# Altium project E-Nose&Alphasense.PrjPCB
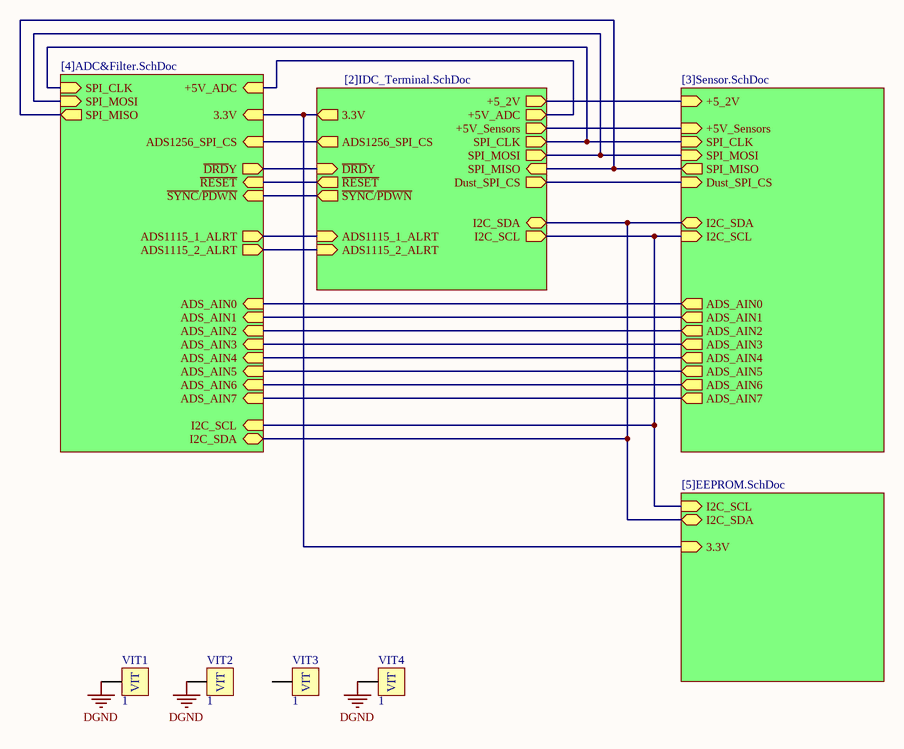
[diagram p0: [1]SheetMain.SchDoc]
5 sheets, 136 parts. Net scope: flat (ports and power ports of the same name join across sheets).
Board file: E-Nose&Alphasense.PcbDoc
Sheets:
  [1]SheetMain.SchDoc
    U_[2]IDC_Terminal = [2]IDC_Terminal.SchDoc
    U_[3]Sensor = [3]Sensor.SchDoc
    U_[4]ADC&Filter = [4]ADC&Filter.SchDoc
    U_[5]EEPROM = [5]EEPROM.SchDoc

## Sheet [1]SheetMain.SchDoc: SheetMain
size A4; Organization: Altium Limited; Address1: SPARC Lab; Address2: SEEE-HUST; Address3: Dai Co Viet, Ha Noi; DocumentNumber: 1; SheetNumber: 1; SheetTotal: 5

### Parts
VIT1  1  [Screw Hole 4mm]
VIT2  1  [Screw Hole 4mm]
VIT3  1  [Screw Hole 4mm]
VIT4  1  [Screw Hole 4mm]

### Sub-sheets
U_[2]IDC_Terminal = [2]IDC_Terminal.SchDoc: 3.3V (out), Dust_SPI_CS (out), SPI_MISO (in), SPI_MOSI (out), SPI_CLK (out), ADS1256_SPI_CS (out), ~{DRD}Y (in), ~{RESET} (out), ~{SYNC}/~{PDWN} (out), I2C_SCL (out), I2C_SDA (bidir), ADS1115_1_ALRT (in), ADS1115_2_ALRT (in), +5_2V (out), +5V_Sensors (out), +5V_ADC (out)
U_[3]Sensor = [3]Sensor.SchDoc: +5_2V (in), SPI_CLK (in), SPI_MISO (out), SPI_MOSI (in), Dust_SPI_CS (in), ADS_AIN0 (out), +5V_Sensors (in), ADS_AIN4 (out), ADS_AIN7 (out), ADS_AIN6 (out), ADS_AIN5 (out), ADS_AIN1 (out), ADS_AIN3 (out), ADS_AIN2 (out), I2C_SDA (bidir), I2C_SCL (in)
U_[4]ADC&Filter = [4]ADC&Filter.SchDoc: ADS_AIN3 (in), ~{DRD}Y (out), ADS1256_SPI_CS (in), ~{RESET} (in), ~{SYNC}/~{PDWN} (in), SPI_MISO (out), +5V_ADC (in), 3.3V (in), ADS_AIN2 (in), ADS_AIN6 (in), ADS_AIN1 (in), ADS_AIN4 (in), ADS_AIN5 (in), ADS_AIN7 (in), SPI_MOSI (in), SPI_CLK (in), ADS_AIN0 (in), I2C_SCL (in), ADS1115_1_ALRT (out), ADS1115_2_ALRT (out), I2C_SDA (bidir)
U_[5]EEPROM = [5]EEPROM.SchDoc: I2C_SCL (in), I2C_SDA (bidir), 3.3V (in)

### Nets
DGND: VIT1.1 VIT2.1 VIT4.1
(unnamed): sheet U_[2]IDC_Terminal/3.3V, sheet U_[4]ADC&Filter/3.3V, sheet U_[5]EEPROM/3.3V
(unnamed): sheet U_[2]IDC_Terminal/Dust_SPI_CS, sheet U_[3]Sensor/Dust_SPI_CS
(unnamed): sheet U_[2]IDC_Terminal/SPI_MISO, sheet U_[3]Sensor/SPI_MISO, sheet U_[4]ADC&Filter/SPI_MISO
(unnamed): sheet U_[2]IDC_Terminal/SPI_MOSI, sheet U_[3]Sensor/SPI_MOSI, sheet U_[4]ADC&Filter/SPI_MOSI
(unnamed): sheet U_[2]IDC_Terminal/SPI_CLK, sheet U_[3]Sensor/SPI_CLK, sheet U_[4]ADC&Filter/SPI_CLK
(unnamed): sheet U_[2]IDC_Terminal/ADS1256_SPI_CS, sheet U_[4]ADC&Filter/ADS1256_SPI_CS
(unnamed): sheet U_[2]IDC_Terminal/~{DRD}Y, sheet U_[4]ADC&Filter/~{DRD}Y
(unnamed): sheet U_[2]IDC_Terminal/~{RESET}, sheet U_[4]ADC&Filter/~{RESET}
(unnamed): sheet U_[2]IDC_Terminal/~{SYNC}/~{PDWN}, sheet U_[4]ADC&Filter/~{SYNC}/~{PDWN}
(unnamed): sheet U_[2]IDC_Terminal/I2C_SCL, sheet U_[3]Sensor/I2C_SCL, sheet U_[4]ADC&Filter/I2C_SCL, sheet U_[5]EEPROM/I2C_SCL
(unnamed): sheet U_[2]IDC_Terminal/I2C_SDA, sheet U_[3]Sensor/I2C_SDA, sheet U_[4]ADC&Filter/I2C_SDA, sheet U_[5]EEPROM/I2C_SDA
(unnamed): sheet U_[2]IDC_Terminal/ADS1115_1_ALRT, sheet U_[4]ADC&Filter/ADS1115_1_ALRT
(unnamed): sheet U_[2]IDC_Terminal/ADS1115_2_ALRT, sheet U_[4]ADC&Filter/ADS1115_2_ALRT
(unnamed): sheet U_[2]IDC_Terminal/+5_2V, sheet U_[3]Sensor/+5_2V
(unnamed): sheet U_[2]IDC_Terminal/+5V_Sensors, sheet U_[3]Sensor/+5V_Sensors
(unnamed): sheet U_[2]IDC_Terminal/+5V_ADC, sheet U_[4]ADC&Filter/+5V_ADC
(unnamed): sheet U_[3]Sensor/ADS_AIN0, sheet U_[4]ADC&Filter/ADS_AIN0
(unnamed): sheet U_[3]Sensor/ADS_AIN4, sheet U_[4]ADC&Filter/ADS_AIN4
(unnamed): sheet U_[3]Sensor/ADS_AIN7, sheet U_[4]ADC&Filter/ADS_AIN7
(unnamed): sheet U_[3]Sensor/ADS_AIN6, sheet U_[4]ADC&Filter/ADS_AIN6
(unnamed): sheet U_[3]Sensor/ADS_AIN5, sheet U_[4]ADC&Filter/ADS_AIN5
(unnamed): sheet U_[3]Sensor/ADS_AIN1, sheet U_[4]ADC&Filter/ADS_AIN1
(unnamed): sheet U_[3]Sensor/ADS_AIN3, sheet U_[4]ADC&Filter/ADS_AIN3
(unnamed): sheet U_[3]Sensor/ADS_AIN2, sheet U_[4]ADC&Filter/ADS_AIN2

Not connected (* = marked no-connect by the designer): VIT3 1

### Notes on the sheet
- Title
- Size:
- Date:
- A4
- Number:
- Time:
- Revision:
- Sheet
- of
- File:

### Library data of the parts
VIT1-VIT4 = VIT: Vit xuyen lo; Chung_Loai: Cắm; Ma_Hang: MH002051; Ten_Linh_Kien: CON 2 KF142R 5.08MM; Don_Vi: Con; Ghi_Chu: *; Kieu_Chan: *

## Sheet [2]IDC_Terminal.SchDoc: IDC&Terminal
size A4; Organization: Altium Limited; Address1: SPARC Lab; Address2: SEEE-HUST; Address3: Dai Co Viet, Ha Noi; DocumentNumber: 2; SheetNumber: 2; SheetTotal: 5
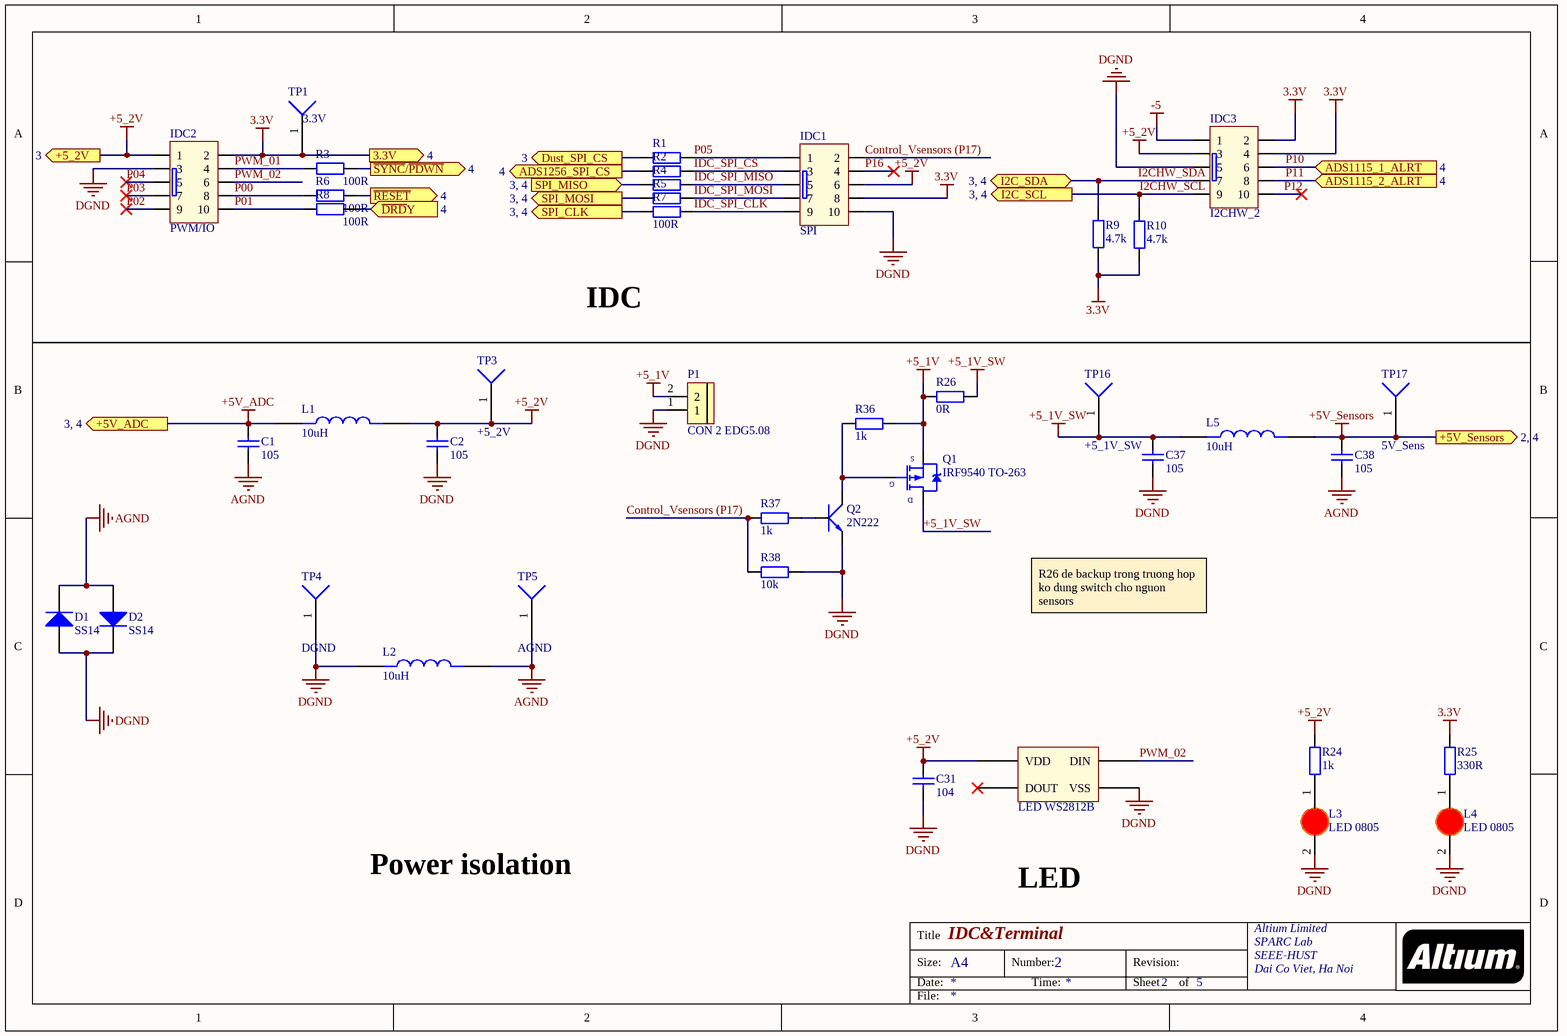
[diagram p1: [2]IDC_Terminal.SchDoc]

### Parts
C1  105  [tu 0805]
C2  105  [tu 0805]
C31  104  [tu 0805]
C37  105  [tu 0805]
C38  105  [tu 0805]
D1  SS14  [DIODE SMA]
D2  SS14  [DIODE SMA]
IDC1  SPI  [IDC10]
IDC2  PWM/IO  [IDC10]
IDC3  I2CHW_2  [IDC10]
L1  10uH  [Inductor 0805]
L2  10uH  [Inductor 0805]
L3  LED 0805  [LED-0805-Red]
L4  LED 0805  [LED-0805-Red]
L5  10uH  [Inductor 0805]
LED_WS2812B  LED WS2812B  [LED-WS2812B]
P1  CON 2 EDG5.08  [CON 2 2EDG5.08]
Q1  IRF9540 TO-263  [TO-263-3_MOSFET]
Q2  2N222  [SOT23-231]
R1  100R  [tro smd 0805]  (value not drawn)
R2  100R  [tro smd 0805]  (value not drawn)
R3  100R  [tro smd 0805]
R4  100R  [tro smd 0805]  (value not drawn)
R5  100R  [tro smd 0805]  (value not drawn)
R6  100R  [tro smd 0805]
R7  100R  [tro smd 0805]
R8  100R  [tro smd 0805]
R9  4.7k  [tro smd 0805]
R10  4.7k  [tro smd 0805]
R24  1k  [tro smd 0805]
R25  330R  [Tro SMD 0805]
R26  0R  [tro smd 1206]
R36  1k  [tro smd 0805]
R37  1k  [tro smd 0805]
R38  10k  [tro smd 0805]
TP1  3.3V  [pad_1.65x1.65_hole_1mm]
TP3  +5_2V  [pad_1.65x1.65_hole_1mm]
TP4  DGND  [pad_1.65x1.65_hole_1mm]
TP5  AGND  [pad_1.65x1.65_hole_1mm]
TP16  +5_1V_SW  [pad_1.65x1.65_hole_1mm]
TP17  5V_Sens  [pad_1.65x1.65_hole_1mm]

### Ports
3.3V (out, see 4), +5_2V (out, see 3), +5V_ADC (out, see 3, 4), +5V_Sensors (out, see 2, 4), ADS1115_1_ALRT (in, see 4), ADS1115_2_ALRT (in, see 4), ADS1256_SPI_CS (out, see 4), Dust_SPI_CS (out, see 3), I2C_SCL (out, see 3, 4), I2C_SDA (bidir, see 3, 4), SPI_CLK (out, see 3, 4), SPI_MISO (in, see 3, 4), SPI_MOSI (out, see 3, 4), ~{DRD}Y (in, see 4), ~{RESET} (out, see 4), ~{SYNC}/~{PDWN} (out, see 4)

### Nets
3.3V: IDC1.8 IDC2.2 IDC3.2 IDC3.4 R9.1 R10.1 R25.2 TP1.1 ; port 3.3V
+5_1V: P1.2 Q1.3(S) R26.1 R36.2
+5_1V_SW: C37.1 L5.2 Q1.2(D) R26.2 TP16.1
+5_2V: C2.1 C31.1 IDC1.6 IDC2.1 IDC3.3 L1.2 LED_WS2812B.1-VDD(VDD) R24.1 TP3.1 ; port +5_2V
+5V_ADC: C1.1 L1.1 ; port +5V_ADC
+5V_Sensors: C38.1 L5.1 TP17.1 ; port +5V_Sensors
-5: IDC3.1
AGND: C1.2 C38.2 D1.2(K) D2.1(A) L2.2 TP5.1
DGND: C2.2 C31.2 C37.2 D1.1(A) D2.2(K) IDC1.10 IDC2.3 IDC3.5 L2.1 L3.2(K) L4.2(K) LED_WS2812B.3-GND(VSS) P1.1 Q2.1(E) R38.2 TP4.1
Control_Vsensors (P17): IDC1.2 R37.1 R38.1
I2CHW_SCL: IDC3.9 R10.2 ; port I2C_SCL  [project net I2C_SCL]
I2CHW_SDA: IDC3.7 R9.2 ; port I2C_SDA  [project net I2C_SDA]
IDC_SPI_CLK: IDC1.9 R7.2
IDC_SPI_CS: IDC1.3 R2.2
IDC_SPI_MISO: IDC1.5 R4.2
IDC_SPI_MOSI: IDC1.7 R5.2
P00: IDC2.8 R6.2
P01: IDC2.10 R8.2
P02: IDC2.9
P03: IDC2.7
P04: IDC2.5
P05: IDC1.1 R1.2
P10: IDC3.6 ; port ADS1115_1_ALRT
P11: IDC3.8 ; port ADS1115_2_ALRT
P12: IDC3.10
P16: IDC1.4
PWM_01: IDC2.4 R3.2
PWM_02: IDC2.6 LED_WS2812B.4-DIN(DIN)
NetH5_2: R7.1 ; port SPI_CLK
NetH5_3: R4.1 ; port SPI_MISO
NetH5_4: R5.1 ; port SPI_MOSI
NetH5_5: R1.1 ; port Dust_SPI_CS
NetL3_1: L3.1(A) R24.2
NetL4_1: L4.1(A) R25.1
NetQ1_1: Q1.1(G) Q2.3(C) R36.1
NetQ2_2: Q2.2(B) R37.2
NetR2_1: R2.1 ; port ADS1256_SPI_CS
NetR3_1: R3.1 ; port ~{SYNC}/~{PDWN}
NetR6_1: R6.1 ; port ~{RESET}
NetR8_1: R8.1 ; port ~{DRD}Y

Not connected (* = marked no-connect by the designer): LED_WS2812B 2-DOUT(DOUT)*

### Notes on the sheet
- IDC
- R26 de backup trong truong hop ko dung switch cho nguon sensors
- Power isolation
- LED
- Title
- Size:
- Date:
- A4
- Number:
- Time:
- Revision:
- Sheet
- of
- File:

### Library data of the parts
C1 C2 C37 C38 = Tu 0805 105 50V 10%: Dán; Don_Vi: Con; So_Chan: 2; Ten_Linh_Kien: Tụ 0805 105-1uF 10% 50V; Ma_Hang: MH004552; Chung_Loai: Dán; Kieu_Chan: *
C31 = Tu 0805 104 50V 10%: Dán; Don_Vi: Con; So_Chan: 2; Ten_Linh_Kien: Tụ 0805 104-100nF 10% 50V; Ma_Hang: MH004551; Chung_Loai: Dán; Kieu_Chan: *
D1 D2 = Diode SS14 ( 1N5819): Dán; Ma_Hang: MH002211; Don_Vi: Con; Ten_Linh_Kien: Diode SS14 DO214 Schottky 1A 40V ( 1N5819 DO214); Chung_Loai: Dán; Ghi_Chu: *; Kieu_Chan: *
IDC1-IDC3 = IDC 5X2: Value: Header 5x2
L1 L2 L5 = Cuon cam 0805: 1.5ÂµH Unshielded Multilayer Inductor 700mA 220mOhm 0805 (2012 Metric); MF: Laird; MP: CPI0805G1R5R-10; Value: *; Price: None; Package: 0805 Laird; Availability: Not in stock; Check_prices: https://www.snapeda.com/parts/CPI0805G1R5R-10/Laird/view-part/5881135/?ref=eda; SnapEDA_Link: https://www.snapeda.com/parts/CPI0805G1R5R-10/Laird/view-part/5881135/?ref=snap
L3 L4 = LED 0805 Do: Dán; Don_Vi: Con; Ma_Hang: MH000897; Ten_Linh_Kien: LED 0805 Màu Đỏ (Red); Ghi_Chu: *; Kieu_Chan: *; Chung_Loai: Dán
P1 = CON 2 EDG5.08: Cắm; Ten_Linh_Kien: CON 2 2EDG5.08-2P 5.08MM ( Xanh Cong); Ma_Hang: MH000759; Ghi_Chu: *; Don_Vi: Con; Kieu_Chan: *; Chung_Loai: Cắm
Q1 = IRF9540 SMD: P-Channel Power MOSFET; Note: Pin 2 is electrically connected to pin 4.; Published: 8-Jun-2000; LatestRevisionDate: 17-Jul-2002; LatestRevisionNote: Re-released for DXP Platform.; DatasheetVersion: PD-9.421C; PackageVersion: Feb-1997; PackageReference: TO-220AB; Publisher: Altium Limited; PackageDescription: TO, Thru-Hole, Vertical, Heatsink Mounted; 3 In-Line Leads; Pitch 2.54 mm; ComponentLink1Description: Manufacturer Link; ComponentLink1URL: http://www.irf.com/; ComponentLink2Description: Datasheet; ComponentLink2URL: http://www.irf.com/product-info/datasheets/data/irf9540.pdf
Q2 = 2N222: NPN 600mW, ECB; Value: C1815
R1-R8 = Tro 0805 5% 100R: Dán; Don_Vi: Con; So_Chan: 2; Ten_Linh_Kien: Trở 0805 5% 100R; Ma_Hang: MH005251; Chung_Loai: Dán; Kieu_Chan: *
R9 R10 = Tro 0805 5% 4.7k: Dán; Don_Vi: Con; So_Chan: 2; Ten_Linh_Kien: Trở 0805 5% 4.7k; Ma_Hang: MH005307; Chung_Loai: Dán; Kieu_Chan: *
R24 = Tro 0805 5% 1k: Dán; Don_Vi: Con; So_Chan: 2; Ten_Linh_Kien: Trở 0805 5% 1k; Ma_Hang: MH005234; Chung_Loai: Dán; Kieu_Chan: *
R25 = Tro 0805 5% 330R: Dán; Don_Vi: Con; So_Chan: 2; Ten_Linh_Kien: Trở 0805 5% 330R; Ma_Hang: MH005337; Chung_Loai: Dán; Kieu_Chan: *
R26 = Tro 1206 5% 0R: Dán; Don_Vi: Con; So_Chan: 2; Ten_Linh_Kien: Trở 1206 5% 0R; Ma_Hang: MH005902; Chung_Loai: Dán; Kieu_Chan: *
R36 R37 = Tro 0805 1% 1k: Dán; Don_Vi: Con; So_Chan: 2; Ten_Linh_Kien: Trở 0805 1% 1k; Ma_Hang: MH005468; Chung_Loai: Dán; Kieu_Chan: *
R38 = Tro 0805 1% 10k: Dán; Don_Vi: Con; So_Chan: 2; Ten_Linh_Kien: Trở 0805 1% 10k; Ma_Hang: MH005473; Chung_Loai: Dán; Kieu_Chan: *
TP1 TP3-TP5 TP16 TP17 = Test Point: Ports: 1; Positions/Loaded: Port1 - 4/2; PerformanceCategory: 3; PCB_Mounting: Thru-Hole; PCB_Thickness: 0.125"; DrillSize: Nominal, Rounded to nearest 0.05mm; PCB_Layout: Complies with Manufacturer's Recommendation.; Published: 25-Jun-2002; DatasheetDocument: 20-Nov-2001; PackageDocument: 20-Nov-2001; PackageReference: 42878-4410; Publisher: Altium Limited; ComponentLink1Description: Manufacturer Link; ComponentLink1URL: http://www.molex.com/; ComponentLink2Description: Datasheet; ComponentLink2URL: http://www.molex.com/cmc_upload/common_files/1212003_42878catalogpage.pdf

## Sheet [3]Sensor.SchDoc: Sensor
size A4; Organization: Altium Limited; Address1: SPARC Lab; Address2: SEEE-HUST; Address3: Dai Co Viet, Ha Noi; DocumentNumber: 3; SheetNumber: 3; SheetTotal: 5
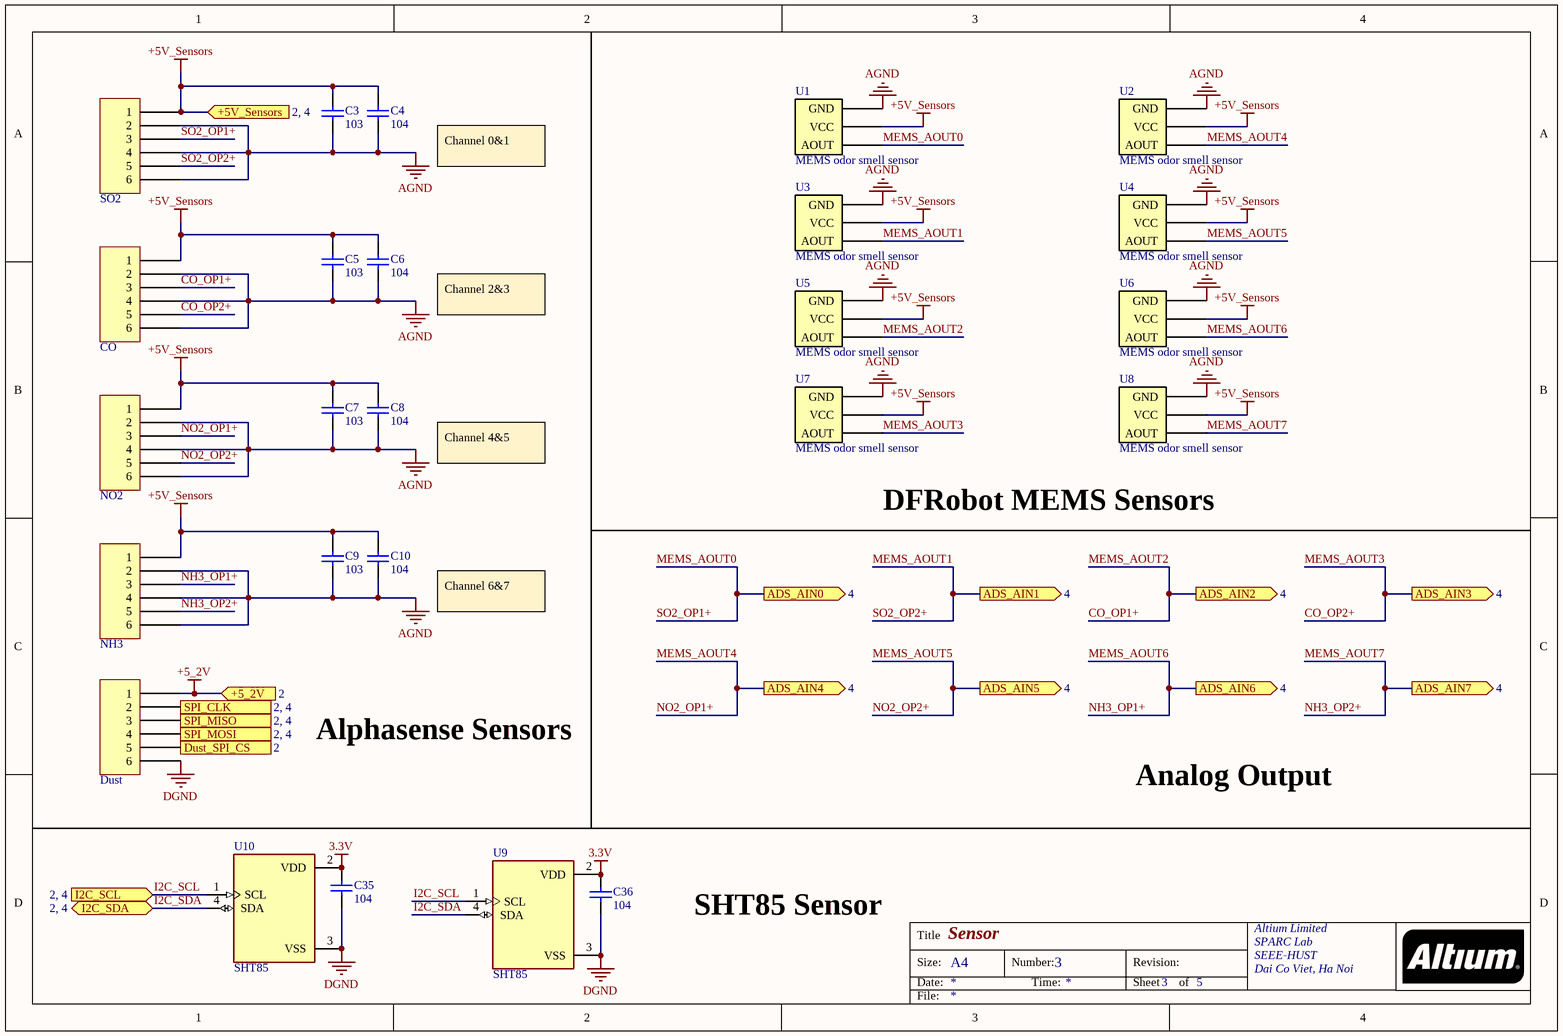
[diagram p2: [3]Sensor.SchDoc]

### Parts
C3  103  [tu 0805]
C4  104  [tu 0805]
C5  103  [tu 0805]
C6  104  [tu 0805]
C7  103  [tu 0805]
C8  104  [tu 0805]
C9  103  [tu 0805]
C10  104  [tu 0805]
C35  104  [tu 0805]
C36  104  [tu 0805]
H1  SO2  [Molex 6p]
H2  CO  [Molex 6p]
H3  NO2  [Molex 6p]
H4  NH3  [Molex 6p]
H5  Dust  [Molex 6p]
U1  MEMS odor smell sensor  [MEMS_odor_sensor]
U2  MEMS odor smell sensor  [MEMS_odor_sensor]
U3  MEMS odor smell sensor  [MEMS_odor_sensor]
U4  MEMS odor smell sensor  [MEMS_odor_sensor]
U5  MEMS odor smell sensor  [MEMS_odor_sensor]
U6  MEMS odor smell sensor  [MEMS_odor_sensor]
U7  MEMS odor smell sensor  [MEMS_odor_sensor]
U8  MEMS odor smell sensor  [MEMS_odor_sensor]
U9  SHT85  [XDCR_SHT85]
U10  SHT85  [XDCR_SHT85]

### Ports
+5_2V (in, see 2), +5V_Sensors (in, see 2, 4), ADS_AIN0 (out, see 4), ADS_AIN1 (out, see 4), ADS_AIN2 (out, see 4), ADS_AIN3 (out, see 4), ADS_AIN4 (out, see 4), ADS_AIN5 (out, see 4), ADS_AIN6 (out, see 4), ADS_AIN7 (out, see 4), Dust_SPI_CS (in, see 2), I2C_SCL (in, see 2, 4), I2C_SDA (bidir, see 2, 4), SPI_CLK (in, see 2, 4), SPI_MISO (out, see 2, 4), SPI_MOSI (in, see 2, 4)

### Nets
3.3V: C35.1 C36.1 U9.2(VDD) U10.2(VDD)
+5_2V: H5.1 ; port +5_2V
+5V_Sensors: C3.1 C4.1 C5.1 C6.1 C7.1 C8.1 C9.1 C10.1 H1.1 H2.1 H3.1 H4.1 U1.2(VCC) U2.2(VCC) U3.2(VCC) U4.2(VCC) U5.2(VCC) U6.2(VCC) U7.2(VCC) U8.2(VCC) ; port +5V_Sensors
AGND: C3.2 C4.2 C5.2 C6.2 C7.2 C8.2 C9.2 C10.2 H1.2 H1.4 H1.6 H2.2 H2.4 H2.6 H3.2 H3.4 H3.6 H4.2 H4.4 H4.6 U1.1(GND) U2.1(GND) U3.1(GND) U4.1(GND) U5.1(GND) U6.1(GND) U7.1(GND) U8.1(GND)
DGND: C35.2 C36.2 H5.6 U9.3(VSS) U10.3(VSS)
CO_OP1+: H2.3 U5.3(AOUT) ; port ADS_AIN2  [also labelled MEMS_AOUT2]
CO_OP2+: H2.5 U7.3(AOUT) ; port ADS_AIN3  [also labelled MEMS_AOUT3]
I2C_SCL: U9.1(SCL) U10.1(SCL) ; port I2C_SCL
I2C_SDA: U9.4(SDA) U10.4(SDA) ; port I2C_SDA
MEMS_AOUT0: H1.3 U1.3(AOUT) ; port ADS_AIN0  [also labelled SO2_OP1+]
MEMS_AOUT1: H1.5 U3.3(AOUT) ; port ADS_AIN1  [also labelled SO2_OP2+]
MEMS_AOUT4: H3.3 U2.3(AOUT) ; port ADS_AIN4  [also labelled NO2_OP1+]
MEMS_AOUT5: H3.5 U4.3(AOUT) ; port ADS_AIN5  [also labelled NO2_OP2+]
MEMS_AOUT6: H4.3 U6.3(AOUT) ; port ADS_AIN6  [also labelled NH3_OP1+]
MEMS_AOUT7: H4.5 U8.3(AOUT) ; port ADS_AIN7  [also labelled NH3_OP2+]
NetH5_2: H5.2 ; port SPI_CLK
NetH5_3: H5.3 ; port SPI_MISO
NetH5_4: H5.4 ; port SPI_MOSI
NetH5_5: H5.5 ; port Dust_SPI_CS

### Notes on the sheet
- Channel 0&1
- Channel 2&3
- Channel 4&5
- DFRobot MEMS Sensors
- Channel 6&7
- Alphasense Sensors
- Analog Output
- SHT85 Sensor
- Title
- Size:
- Date:
- A4
- Number:
- Time:
- Revision:
- Sheet
- of
- File:

### Library data of the parts
C3 C5 C7 C9 = Tu 0805 103 50V 10%_1: Dán; Don_Vi: Con; So_Chan: 2; Ten_Linh_Kien: Tụ 0805 102-1nF 10% 50V; Ma_Hang: MH004549; Chung_Loai: Dán; Kieu_Chan: *
C4 C6 C8 C10 C35 C36 = Tu 0805 104 50V 10%: as C31 on sheet [2]IDC_Terminal; Chung_Loai: Dán; Kieu_Chan: *
H1-H5 = Molex 6p
U1-U8 = MEMS odor smell sensor: DFRobot MEMS Odor Smell Gas Detection Sensor
U9 U10 = SHT85: Humidity Temperature Sensor 0 ~ 100% RH Digital Â±1.5% RH 8s Through Hole; MF: Sensirion AG; SnapEDA_Link: https://www.snapeda.com/parts/SHT85/Sensirion%20AG/view-part/3601545/?ref=snap; Value: *; Digi-Key_Part_Number: 1649-1110-ND; Digi-Key_Purchase_URL: https://www.digikey.com/product-detail/en/sensirion-ag/SHT85/1649-1110-ND/9666378?utm_source=snapeda&utm_medium=aggregator&utm_campaign=symbol; MP: SHT85; Package: SIP-4 Sensirion AG

## Sheet [4]ADC&Filter.SchDoc: ADC&Filter
size A3; Organization: Altium Limited; Address1: SPARC Lab; Address2: SEEE-HUST; Address3: Dai Co Viet, Ha Noi; DocumentNumber: 4; SheetNumber: 4; SheetTotal: 5
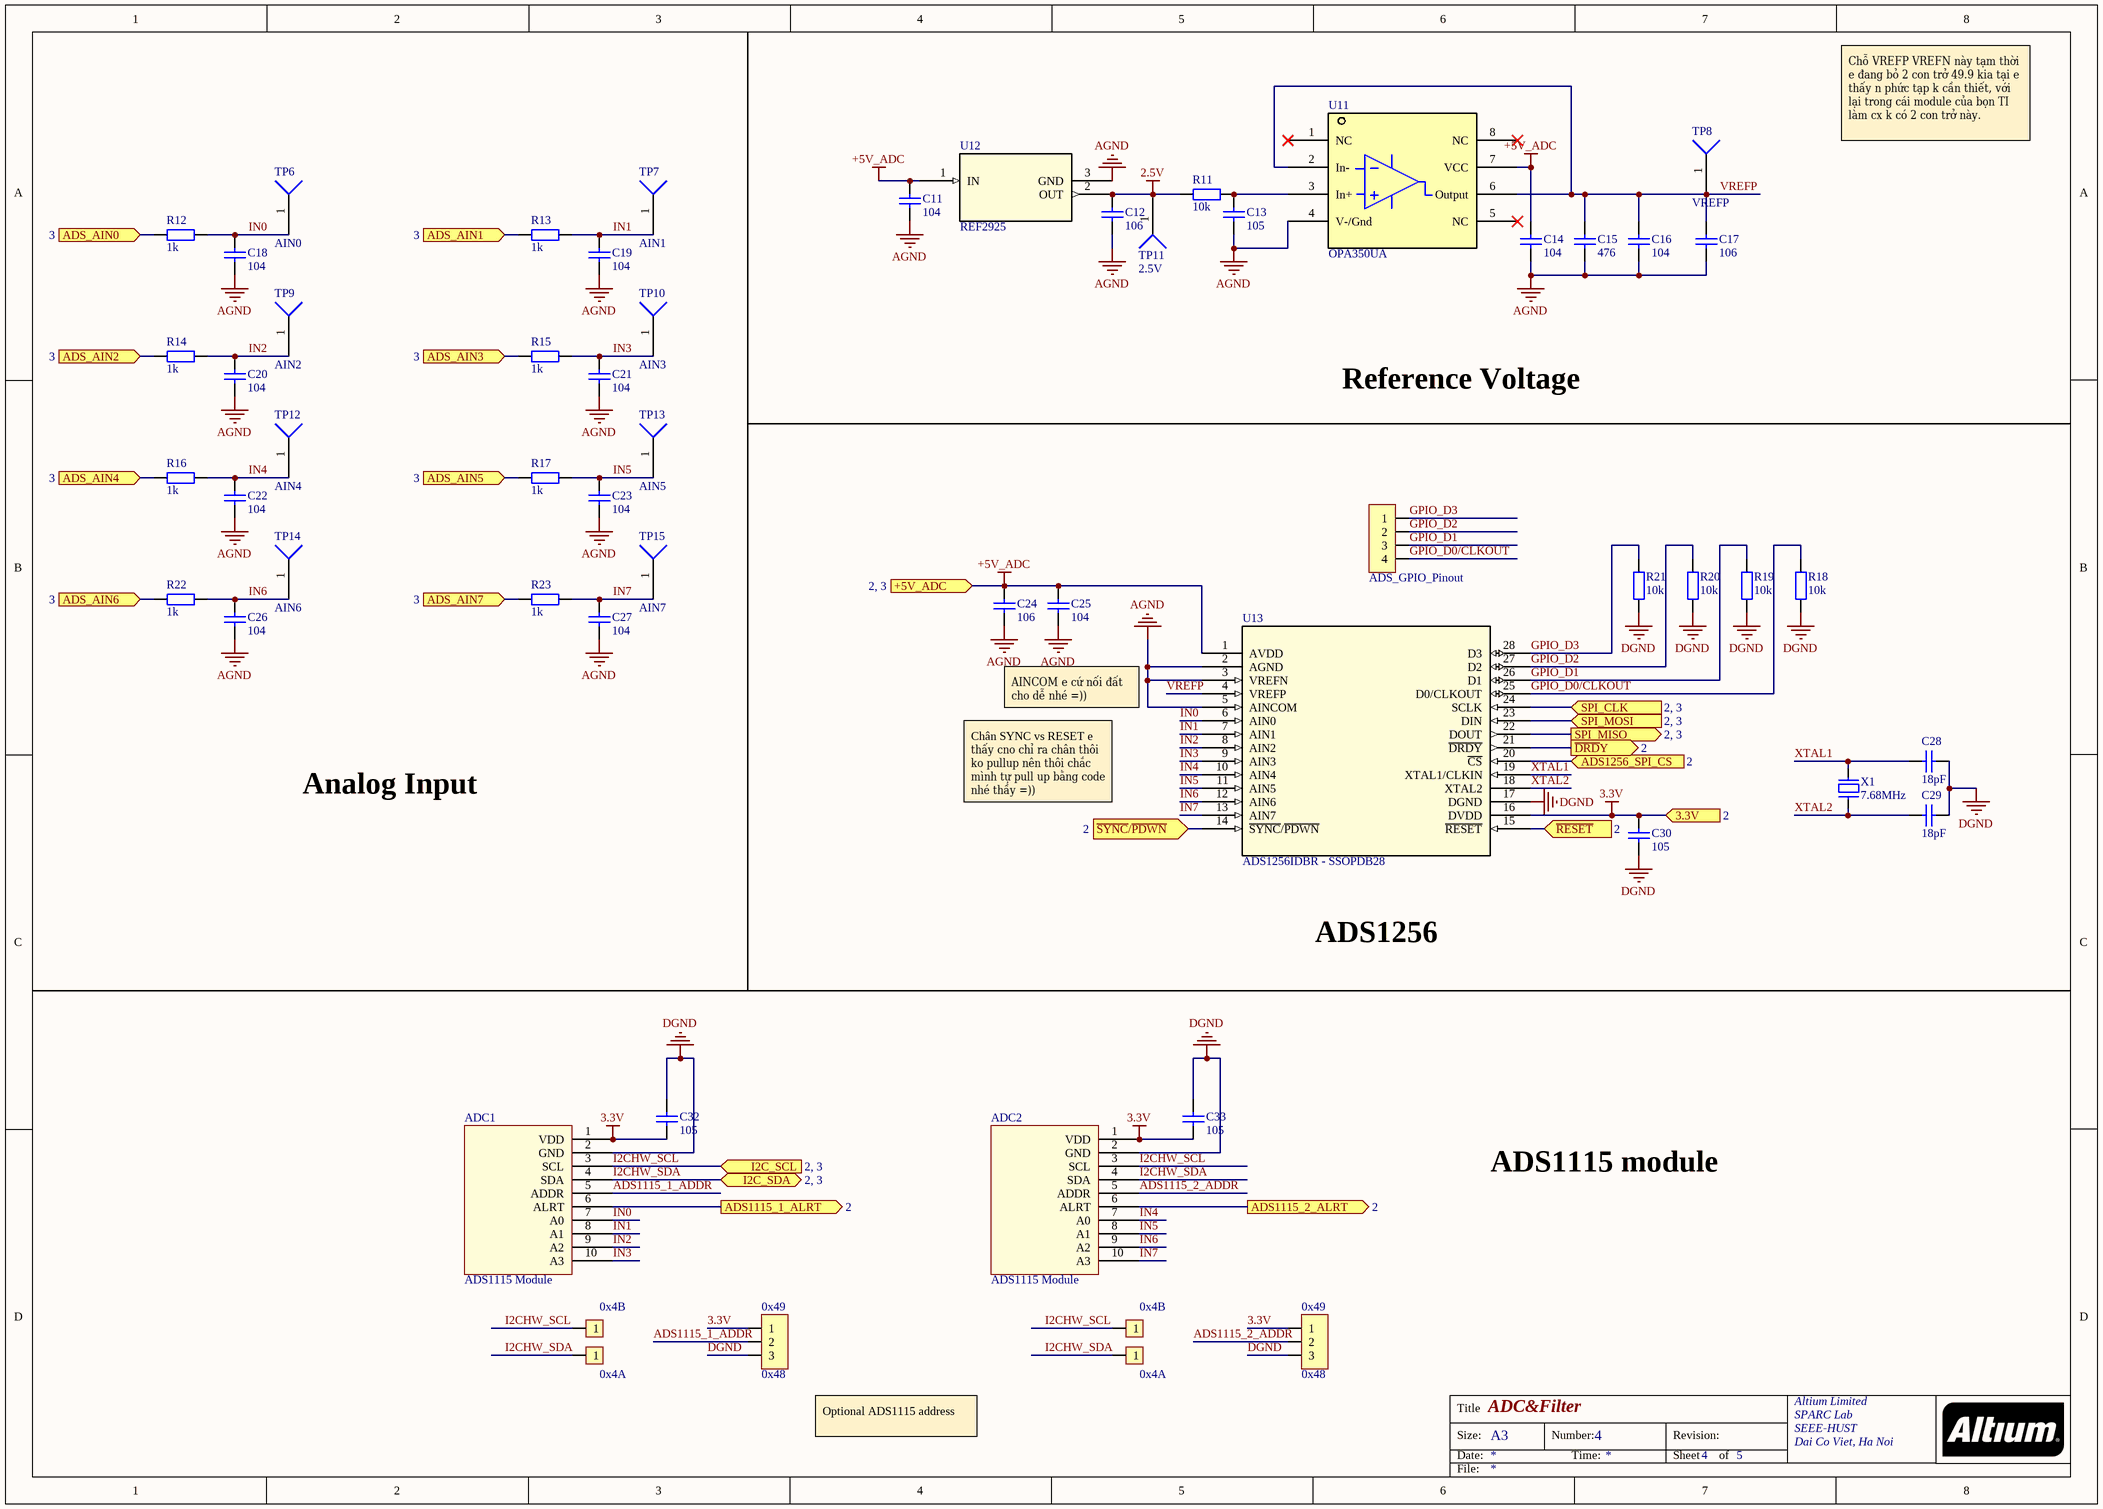
[diagram p3: [4]ADC&Filter.SchDoc]

### Parts
ADC1  ADS1115 Module  [ADS1115]
ADC2  ADS1115 Module  [ADS1115]
C11  104  [tu 0805]
C12  106  [tu 0805]
C13  105  [tu 0805]
C14  104  [tu 0805]
C15  476  [tu 0805]
C16  104  [tu 0805]
C17  106  [tu 0805]
C18  104  [tu 0805]
C19  104  [tu 0805]
C20  104  [tu 0805]
C21  104  [tu 0805]
C22  104  [tu 0805]
C23  104  [tu 0805]
C24  106  [tu 0805]
C25  104  [tu 0805]
C26  104  [tu 0805]
C27  104  [tu 0805]
C28  18pF  [tu 0805]
C29  18pF  [tu 0805]
C30  105  [tu 0805]
C32  105  [tu 0805]
C33  105  [tu 0805]
JP1  ADS_GPIO_Pinout  [JP 1x4 DT]
JP5  JP 1x3 2.54  [JP 1x3 DT]  (value not drawn)
JP6  JP 1x3 2.54  [JP 1x3 DT]  (value not drawn)
JP7  JP 1x1 2.54  [JP 1x1 DT]  (value not drawn)
JP8  JP 1x1 2.54  [JP 1x1 DT]  (value not drawn)
JP9  JP 1x1 2.54  [JP 1x1 DT]  (value not drawn)
JP10  JP 1x1 2.54  [JP 1x1 DT]  (value not drawn)
R11  10k  [tro smd 0805]
R12  1k  [tro smd 0805]
R13  1k  [tro smd 0805]
R14  1k  [tro smd 0805]
R15  1k  [tro smd 0805]
R16  1k  [tro smd 0805]
R17  1k  [tro smd 0805]
R18  10k  [tro smd 0805]
R19  10k  [tro smd 0805]
R20  10k  [tro smd 0805]
R21  10k  [tro smd 0805]
R22  1k  [tro smd 0805]
R23  1k  [tro smd 0805]
TP6  AIN0  [pad_1.65x1.65_hole_1mm]
TP7  AIN1  [pad_1.65x1.65_hole_1mm]
TP8  VREFP  [pad_1.65x1.65_hole_1mm]
TP9  AIN2  [pad_1.65x1.65_hole_1mm]
TP10  AIN3  [pad_1.65x1.65_hole_1mm]
TP11  2.5V  [pad_1.65x1.65_hole_1mm]
TP12  AIN4  [pad_1.65x1.65_hole_1mm]
TP13  AIN5  [pad_1.65x1.65_hole_1mm]
TP14  AIN6  [pad_1.65x1.65_hole_1mm]
TP15  AIN7  [pad_1.65x1.65_hole_1mm]
U11  OPA350UA  [SOIC 8_127P599X175]
U12  REF2925  [SOT23-DBZ3]
U13  ADS1256IDBR - SSOPDB28  [SSOPDB28]
X1  7.68MHz  [Thach Anh 2 chan SMD]

### Ports
3.3V (in, see 2), +5V_ADC (in, see 2, 3), ADS1115_1_ALRT (out, see 2), ADS1115_2_ALRT (out, see 2), ADS1256_SPI_CS (in, see 2), ADS_AIN0 (in, see 3), ADS_AIN1 (in, see 3), ADS_AIN2 (in, see 3), ADS_AIN3 (in, see 3), ADS_AIN4 (in, see 3), ADS_AIN5 (in, see 3), ADS_AIN6 (in, see 3), ADS_AIN7 (in, see 3), I2C_SCL (in, see 2, 3), I2C_SDA (bidir, see 2, 3), SPI_CLK (in, see 2, 3), SPI_MISO (out, see 2, 3), SPI_MOSI (in, see 2, 3), ~{DRD}Y (out, see 2), ~{RESET} (in, see 2), ~{SYNC}/~{PDWN} (in, see 2)

### Nets
2.5V: C12.1 R11.1 TP11.1 U12.2(OUT)
3.3V: ADC1.1(VDD) ADC2.1(VDD) C30.1 C32.1 C33.1 JP5.1 JP6.1 U13.16(DVDD) ; port 3.3V
+5V_ADC: C11.1 C14.1 C24.1 C25.1 U11.7(VCC) U12.1(IN) U13.1(AVDD) ; port +5V_ADC
AGND: C11.2 C12.2 C13.2 C14.2 C15.2 C16.2 C17.2 C18.2 C19.2 C20.2 C21.2 C22.2 C23.2 C24.2 C25.2 C26.2 C27.2 U11.4(V-/Gnd) U12.3(GND) U13.2(AGND) U13.3(VREFN) U13.5(AINCOM)
DGND: ADC1.2(GND) ADC2.2(GND) C28.1 C29.1 C30.2 C32.2 C33.2 JP5.3 JP6.3 R18.1 R19.2 R20.2 R21.2 U13.17(DGND)
ADS1115_1_ADDR: ADC1.5(ADDR) JP5.2
ADS1115_2_ADDR: ADC2.5(ADDR) JP6.2
CO_OP1+: R14.1 ; port ADS_AIN2
CO_OP2+: R15.1 ; port ADS_AIN3
GPIO_D0/CLKOUT: JP1.4 R18.2 U13.25(D0/CLKOUT)
GPIO_D1: JP1.3 R19.1 U13.26(D1)
GPIO_D2: JP1.2 R20.1 U13.27(D2)
GPIO_D3: JP1.1 R21.1 U13.28(D3)
I2CHW_SCL: ADC1.3(SCL) ADC2.3(SCL) JP7.1 JP8.1 ; port I2C_SCL  [project net I2C_SCL]
I2CHW_SDA: ADC1.4(SDA) ADC2.4(SDA) JP9.1 JP10.1 ; port I2C_SDA  [project net I2C_SDA]
IN0: ADC1.7(A0) C18.1 R12.2 TP6.1 U13.6(AIN0)
IN1: ADC1.8(A1) C19.1 R13.2 TP7.1 U13.7(AIN1)
IN2: ADC1.9(A2) C20.1 R14.2 TP9.1 U13.8(AIN2)
IN3: ADC1.10(A3) C21.1 R15.2 TP10.1 U13.9(AIN3)
IN4: ADC2.7(A0) C22.1 R16.2 TP12.1 U13.10(AIN4)
IN5: ADC2.8(A1) C23.1 R17.2 TP13.1 U13.11(AIN5)
IN6: ADC2.9(A2) C26.1 R22.2 TP14.1 U13.12(AIN6)
IN7: ADC2.10(A3) C27.1 R23.2 TP15.1 U13.13(AIN7)
MEMS_AOUT0: R12.1 ; port ADS_AIN0
MEMS_AOUT1: R13.1 ; port ADS_AIN1
MEMS_AOUT4: R16.1 ; port ADS_AIN4
MEMS_AOUT5: R17.1 ; port ADS_AIN5
MEMS_AOUT6: R22.1 ; port ADS_AIN6
MEMS_AOUT7: R23.1 ; port ADS_AIN7
P10: ADC1.6(ALRT) ; port ADS1115_1_ALRT
P11: ADC2.6(ALRT) ; port ADS1115_2_ALRT
VREFP: C15.1 C16.1 C17.1 TP8.1 U11.2(In-) U11.6(Output) U13.4(VREFP)
XTAL1: C28.2 U13.19(XTAL1/CLKIN) X1.2
XTAL2: C29.2 U13.18(XTAL2) X1.1
NetC13_1: C13.1 R11.2 U11.3(In+)
NetH5_2: U13.24(SCLK) ; port SPI_CLK
NetH5_3: U13.22(DOUT) ; port SPI_MISO
NetH5_4: U13.23(DIN) ; port SPI_MOSI
NetR2_1: U13.20(~{CS}) ; port ADS1256_SPI_CS
NetR3_1: U13.14(~{SYNC}/~{PDWN}) ; port ~{SYNC}/~{PDWN}
NetR6_1: U13.15(~{RESET}) ; port ~{RESET}
NetR8_1: U13.21(~{DRDY}) ; port ~{DRD}Y

Not connected (* = marked no-connect by the designer): U11 1(NC)* 5(NC)* 8(NC)*

### Notes on the sheet
- Chỗ VREFP VREFN này tạm thời e đang bỏ 2 con trở 49.9 kia tại e thấy n phức tạp k cần thiết, với lại trong cái module của bọn TI làm cx k có 2 con trở này.
- Reference Voltage
- AINCOM e cứ nối đất cho dễ nhé =))
- Analog Input
- Chân SYNC vs RESET e thấy cno chỉ ra chân thôi ko pullup nên thôi chắc mình tự pull up bằng code nhé thầy =))
- ADS1256
- ADS1115 module
- (near JP7) 0x4B
- (near JP5) 0x49
- (near JP8) 0x4B
- (near JP6) 0x49
- (near JP9) 0x4A
- (near JP5) 0x48
- (near JP10) 0x4A
- (near JP6) 0x48
- Optional ADS1115 address
- Title
- Size:
- Date:
- A3
- Number:
- Time:
- Revision:
- Sheet
- of
- File:

### Library data of the parts
ADC1 ADC2 = ADS1115 Module ADC
C11 C14 C16 C18-C23 C25-C27 = Tu 0805 104 50V 10%: as C31 on sheet [2]IDC_Terminal; Chung_Loai: Dán; Kieu_Chan: *
C12 C17 C24 = Tu 0805 106 16V 10%: Dán; Ten_Linh_Kien: Tụ 0805 106-10uF 10% 16V; So_Chan: 2; Don_Vi: Con; Ma_Hang: MH004553; Chung_Loai: Dán; Kieu_Chan: *
C13 C30 C32 C33 = Tu 0805 105 50V 10%: as C1 on sheet [2]IDC_Terminal; Chung_Loai: Dán; Kieu_Chan: *
C15 = Tu 0805 475 25V 20%: Dán; Don_Vi: Con; So_Chan: 2; Ten_Linh_Kien: Tụ 0805 475-4.7uF 20% 25V; Ma_Hang: MH004276; Chung_Loai: Dán; Kieu_Chan: *
C28 C29 = Tu 0805 18pF 50V 10%_1: Dán; Don_Vi: Con; Ten_Linh_Kien: Tụ 0805 20P 10% 50V; So_Chan: 2; Ma_Hang: MH004558; Chung_Loai: Dán; Kieu_Chan: *
JP1 = JP 1x4 2.54 Duc Thang: Cắm; Ten_Linh_Kien: Jump Đơn Đực 2.54MM 1x40P Thẳng 11MM; Don_Vi: Con; Ma_Hang: MH000903; Ghi_Chu: *; Kieu_Chan: *; Chung_Loai: Cắm
JP5 JP6 = JP 1x3 2.54 Duc Thang: Cắm; Ten_Linh_Kien: Jump Đơn Đực 2.54MM 1x40P Thẳng 11MM; Don_Vi: Con; Ma_Hang: MH000903; Ghi_Chu: *; Kieu_Chan: *; Chung_Loai: Cắm
JP7-JP10 = JP 1x1 2.54 Duc Thang: Cắm; Ten_Linh_Kien: Jump Đơn Đực 2.54MM 1x40P Thẳng 11MM; Don_Vi: Con; Ma_Hang: MH000903; Ghi_Chu: *; Kieu_Chan: *; Chung_Loai: Cắm
R11 R18-R21 = Tro 0805 1% 10k: as R38 on sheet [2]IDC_Terminal; Chung_Loai: Dán; Kieu_Chan: *
R12-R17 R22 R23 = Tro 0805 1% 1k: as R36 on sheet [2]IDC_Terminal; Chung_Loai: Dán; Kieu_Chan: *
TP6-TP15 = Test Point: as TP1 on sheet [2]IDC_Terminal; Published: 25-Jun-2002; DatasheetDocument: 20-Nov-2001; PackageDocument: 20-Nov-2001; PackageReference: 42878-4410; Publisher: Altium Limited; ComponentLink1Description: Manufacturer Link; ComponentLink1URL: http://www.molex.com/; ComponentLink2Description: Datasheet; ComponentLink2URL: http://www.molex.com/cmc_upload/common_files/1212003_42878catalogpage.pdf
U11 = OPA350: Op-amp OPA350
U12 = REF2925AIDBZR: SOT-23 CMOS 2.5V Voltage Reference; Mfr_Name: Texas Instruments; RefDes: RefDes; Type: Type
U13 = ADS1256IDBR - SSOPDB28: Very Low Noise, 24-Bit Analog-to-Digital Converter; Mfr_Name: Texas Instruments; RefDes: RefDes; Type: Type
X1 = Thach Anh 2 chan SMD: Crystal For all Crystal 2pin.; Value: 4Mhz

## Sheet [5]EEPROM.SchDoc: EEPROM
size A4; Organization: Altium Limited; Address1: SPARC Lab; Address2: SEEE-HUST; Address3: Dai Co Viet, Ha Noi
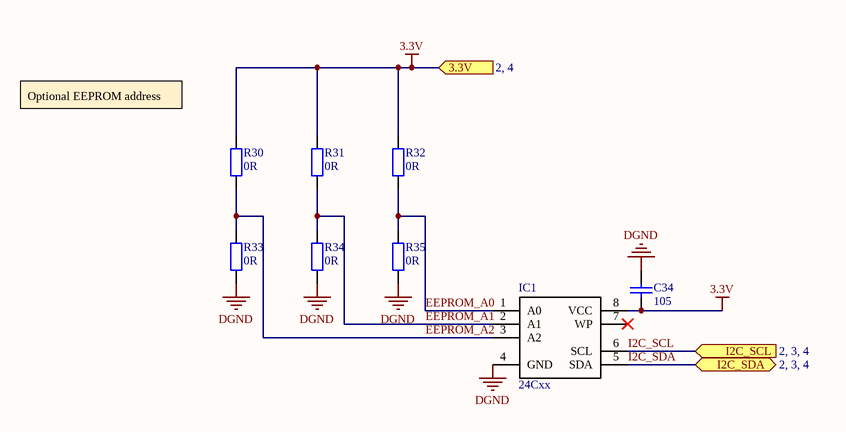
[diagram p4: [5]EEPROM.SchDoc]

### Parts
C34  105  [tu 0805]
IC1  24Cxx  [SO8]
R30  0R  [tro smd 0805]
R31  0R  [tro smd 0805]
R32  0R  [tro smd 0805]
R33  0R  [tro smd 0805]
R34  0R  [tro smd 0805]
R35  0R  [tro smd 0805]

### Ports
3.3V (in, see 2, 4), I2C_SCL (in, see 2, 3, 4), I2C_SDA (bidir, see 2, 3, 4)

### Nets
3.3V: C34.2 IC1.8(VCC) R30.2 R31.2 R32.2 ; port 3.3V
DGND: C34.1 IC1.4(GND) R33.1 R34.1 R35.1
EEPROM_A0: IC1.1(A0) R32.1 R35.2
EEPROM_A1: IC1.2(A1) R31.1 R34.2
EEPROM_A2: IC1.3(A2) R30.1 R33.2
I2C_SCL: IC1.6(SCL) ; port I2C_SCL
I2C_SDA: IC1.5(SDA) ; port I2C_SDA

Not connected (* = marked no-connect by the designer): IC1 7(WP)*

### Notes on the sheet
- Optional EEPROM address
- Title
- Size:
- Date:
- A4
- Number:
- Time:
- Revision:
- Sheet
- of
- File:

### Library data of the parts
C34 = Tu 0805 105 50V 10%: as C1 on sheet [2]IDC_Terminal; Chung_Loai: Dán; Kieu_Chan: *
IC1 = 24Cxx: Standard 2-Wire Bus Interface Serial EEPROM; Value: DIP 8; Value: 24Cxx; Copyright by: VanDungEvn
R30-R35 = Tro 0805 5% 0R: Dán; Don_Vi: Con; So_Chan: 2; Ten_Linh_Kien: Trở 0805 5% 0R; Ma_Hang: MH005230; Chung_Loai: Dán; Kieu_Chan: *

## Nets that join several sheets
3.3V: [2]IDC_Terminal (8 pins), [3]Sensor (C35.1 C36.1 U9.2 U10.2), [4]ADC&Filter (8 pins), [5]EEPROM (5 pins)
+5_2V: [2]IDC_Terminal (9 pins), [3]Sensor (H5.1)
+5V_ADC: [2]IDC_Terminal (C1.1 L1.1), [4]ADC&Filter (7 pins)
+5V_Sensors: [2]IDC_Terminal (C38.1 L5.1 TP17.1), [3]Sensor (20 pins)
AGND: [2]IDC_Terminal (6 pins), [3]Sensor (28 pins), [4]ADC&Filter (22 pins)
DGND: [1]SheetMain (VIT1.1 VIT2.1 VIT4.1), [2]IDC_Terminal (16 pins), [3]Sensor (5 pins), [4]ADC&Filter (14 pins), [5]EEPROM (5 pins)
CO_OP1+: [3]Sensor (H2.3 U5.3), [4]ADC&Filter (R14.1)
CO_OP2+: [3]Sensor (H2.5 U7.3), [4]ADC&Filter (R15.1)
I2C_SCL: [2]IDC_Terminal (IDC3.9 R10.2), [3]Sensor (U9.1 U10.1), [4]ADC&Filter (ADC1.3 ADC2.3 JP7.1 JP8.1), [5]EEPROM (IC1.6)
I2C_SDA: [2]IDC_Terminal (IDC3.7 R9.2), [3]Sensor (U9.4 U10.4), [4]ADC&Filter (ADC1.4 ADC2.4 JP9.1 JP10.1), [5]EEPROM (IC1.5)
MEMS_AOUT0: [3]Sensor (H1.3 U1.3), [4]ADC&Filter (R12.1)
MEMS_AOUT1: [3]Sensor (H1.5 U3.3), [4]ADC&Filter (R13.1)
MEMS_AOUT4: [3]Sensor (H3.3 U2.3), [4]ADC&Filter (R16.1)
MEMS_AOUT5: [3]Sensor (H3.5 U4.3), [4]ADC&Filter (R17.1)
MEMS_AOUT6: [3]Sensor (H4.3 U6.3), [4]ADC&Filter (R22.1)
MEMS_AOUT7: [3]Sensor (H4.5 U8.3), [4]ADC&Filter (R23.1)
NetH5_2: [2]IDC_Terminal (R7.1), [3]Sensor (H5.2), [4]ADC&Filter (U13.24)
NetH5_3: [2]IDC_Terminal (R4.1), [3]Sensor (H5.3), [4]ADC&Filter (U13.22)
NetH5_4: [2]IDC_Terminal (R5.1), [3]Sensor (H5.4), [4]ADC&Filter (U13.23)
NetH5_5: [2]IDC_Terminal (R1.1), [3]Sensor (H5.5)
NetR2_1: [2]IDC_Terminal (R2.1), [4]ADC&Filter (U13.20)
NetR3_1: [2]IDC_Terminal (R3.1), [4]ADC&Filter (U13.14)
NetR6_1: [2]IDC_Terminal (R6.1), [4]ADC&Filter (U13.15)
NetR8_1: [2]IDC_Terminal (R8.1), [4]ADC&Filter (U13.21)
P10: [2]IDC_Terminal (IDC3.6), [4]ADC&Filter (ADC1.6)
P11: [2]IDC_Terminal (IDC3.8), [4]ADC&Filter (ADC2.6)